# Altium schematic sheet Environmental Sensors.SchDoc
size A4; DrawnBy: Dylan Vogel, Lorna Lan; DocumentNumber: 19; Revision: v4.2; SheetNumber: 19; SheetTotal: 20
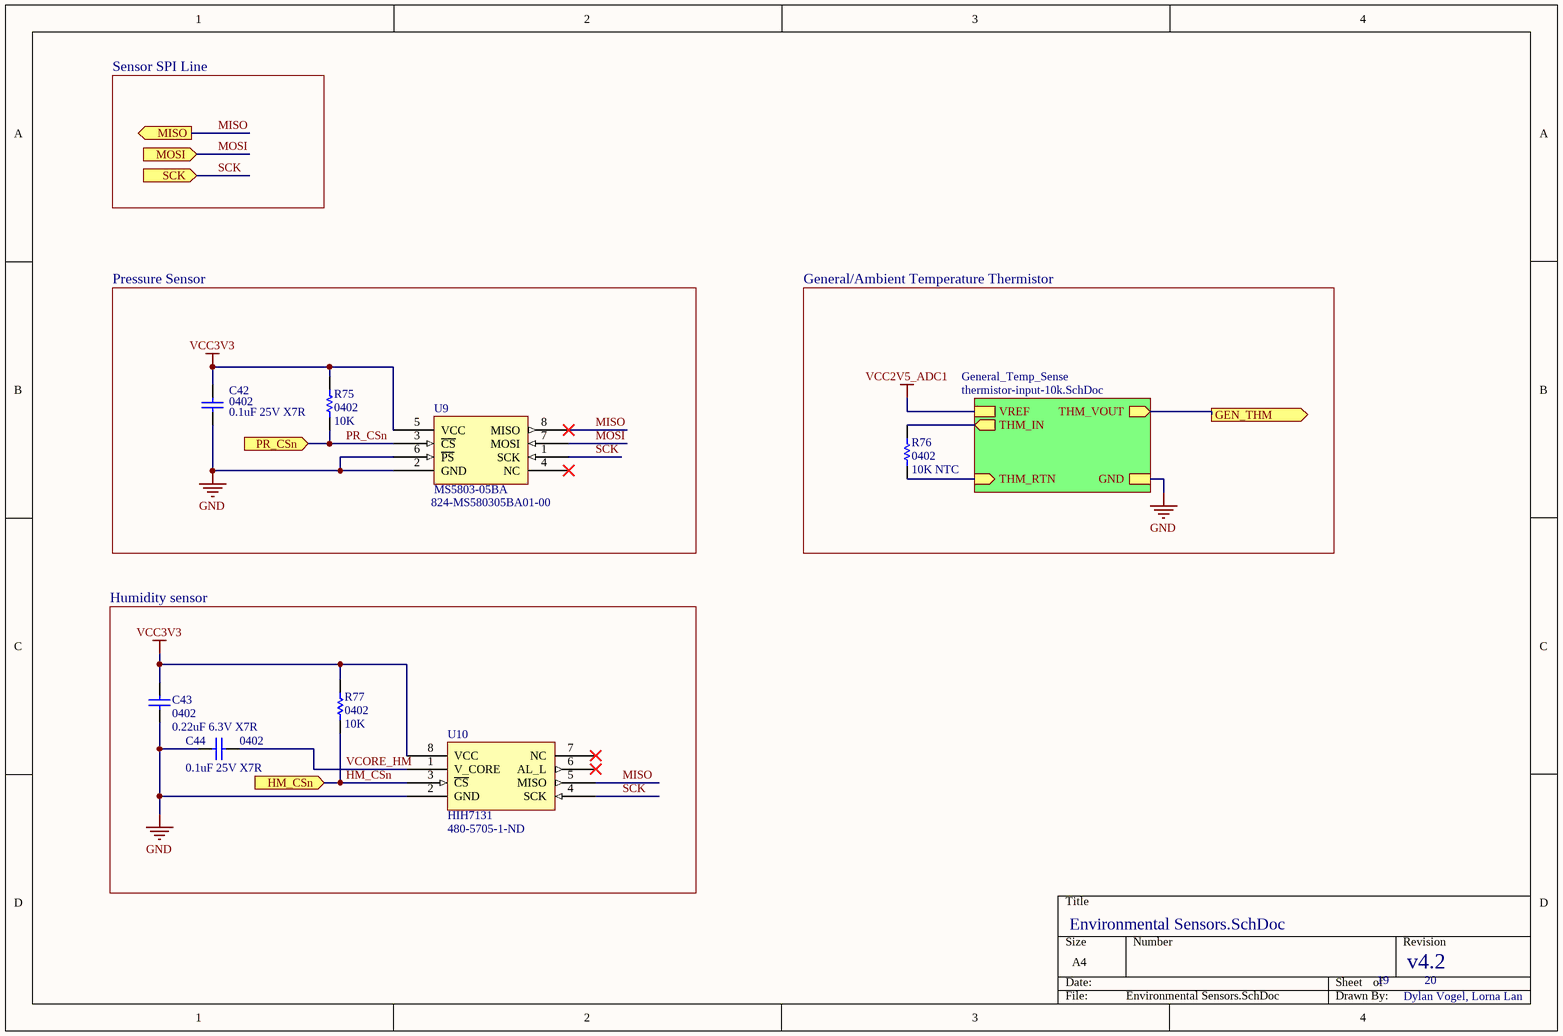
[diagram p0: Environmental Sensors.SchDoc]

## Parts
C42  0402  value 0.1uF 25V X7R  [CAP0402R]
C43  0402  value 0.22uF 6.3V X7R  [CAP0402R]
C44  0402  value 0.1uF 25V X7R  [CAP0402R]
R75  0402  value 10K  [RES0402R]
R76  0402  value 10K NTC  [RES0402R]
R77  0402  value 10K  [RES0402R]
U9  MS5803-05BA  Supplier Part Number 1: 824-MS580305BA01-00  [MS5803_125P640x620-8N]
U10  HIH7131  Supplier Part Number 1: 480-5705-1-ND  [SOIC127P500X600-8N]

## Blocks framed on the sheet
Pressure Sensor: C42 R75 U9
General/Ambient Temperature Thermistor: R76
Humidity sensor: C43 C44 R77 U10

## Sub-sheets
General_Temp_Sense = thermistor-input-10k.SchDoc: GND, VREF, THM_RTN (in), THM_IN (out), THM_VOUT (out)

## Ports
GEN_THM (out), HM_CSn (in), MISO (out), MOSI (in), PR_CSn (in), SCK (in)

## Nets
GND: C42.1 C43.1 C44.1 U9.2(GND) U9.6(~{PS}) U10.2(GND) ; sheet General_Temp_Sense/GND
VCC2V5_ADC1: sheet General_Temp_Sense/VREF
VCC3V3: C42.2 C43.2 R75.2 R77.2 U9.5(VCC) U10.8(VCC)
GEN_THM: port GEN_THM, sheet General_Temp_Sense/THM_VOUT
HM_CSn: R77.1 U10.3(~{CS}) ; port HM_CSn
MISO: U9.8(MISO) U10.5(MISO) ; port MISO
MOSI: U9.7(MOSI) ; port MOSI
PR_CSn: R75.1 U9.3(~{CS}) ; port PR_CSn
SCK: U9.1(SCK) U10.4(SCK) ; port SCK
VCORE_HM: C44.2 U10.1(V_CORE)
NetR76_1: R76.1 ; sheet General_Temp_Sense/THM_RTN
NetR76_2: R76.2 ; sheet General_Temp_Sense/THM_IN

Not connected (* = marked no-connect by the designer): U9 4(NC)*; U10 6(AL_L)* 7(NC)*

## Notes on the sheet
- Sensor SPI Line

## Library data of the parts
C42-C44 = CAP0402: 0402 capacitor
R75 R77 = RES0402: 0402 resistor; Manufacturer: Panasonic; Manufacturer Part Number: ERJ-2RKF1002X; Resistance: 10kR; Power Rating: 100mW; Tolerance: 1%; Voltage Rating: 50V; Temperature Coefficient: 100ppm/°C; Supplier 1: Digi-Key; Supplier Part Number 1: P10.0KLCT-ND; Stock 1: 14350001; Pricing 1: 1=0.1, 10=0.045, 100=0.0183, 1000=0.00823, 2500=0.00715, 5000=0.0059 (USD); Mount: Surface Mount; Case/Package: 0402; Number of Pins: 2; Case Code (Metric): 1005; Case Code (Imperial): 0402; Contact Plating: Tin; Min Operating Temperature: -55°C; Max Operating Temperature: 155°C; Packaging: Tape and Reel; Package Quantity: 1; Composition: Thick Film; Number of Terminations: 2; Termination: SMD/SMT; Military Standard: Not; Max Power Dissipation: 100mW; Voltage Rating (DC): 50V; Features: Automotive AEC-Q200; Length: 1mm; Height: 0.35mm; Width: 0.02inch; Depth: 0.5mm; Radiation Hardening: No; REACH SVHC: No SVHC; Lead Free: Lead Free; ComponentLink1URL: http://industrial.panasonic.com/www-data/pdf/AOA0000/AOA0000CE2.pdf?src-supplier=Future+Electronics; ComponentLink1Description: http://industrial.panasonic.com/www-data/pdf/AOA0000/AOA0000CE2.pdf?src-supplier=Future+Electronics; ComponentLink2URL: http://industrial.panasonic.com/www-data/pdf/AOA0000/AOA0000CE2.pdf?src-supplier=Avnet+Europe; ComponentLink2Description: http://industrial.panasonic.com/www-data/pdf/AOA0000/AOA0000CE2.pdf?src-supplier=Avnet+Europe; ComponentLink3URL: https://industrial.panasonic.com/cdbs/www-data/pdf/RDA0000/DMA0000COL11.pdf?src-supplier=Mouser; ComponentLink3Description: https://industrial.panasonic.com/cdbs/www-data/pdf/RDA0000/DMA0000COL11.pdf?src-supplier=Mouser; ComponentLink4URL: http://www.farnell.com/datasheets/1678782.pdf?src-supplier=Element14; ComponentLink4Description: http://www.farnell.com/datasheets/1678782.pdf?src-supplier=Element14; ComponentLink5URL: http://www.farnell.com/datasheets/1911175.pdf?src-supplier=Farnell; ComponentLink5Description: http://www.farnell.com/datasheets/1911175.pdf?src-supplier=Farnell; ComponentLink6URL: http://www.jameco.com/Jameco/Products/ProdDS/1987020.pdf?src-supplier=Jameco; ComponentLink6Description: http://www.jameco.com/Jameco/Products/ProdDS/1987020.pdf?src-supplier=Jameco; ComponentLink7URL: http://industrial.panasonic.com/www-data/pdf/AOA0000/AOA0000CE2.pdf?src-supplier=Avnet; ComponentLink7Description: http://industrial.panasonic.com/www-data/pdf/AOA0000/AOA0000CE2.pdf?src-supplier=Avnet; ComponentLink8URL: http://www.alliedelec.com/m/d/623f45ff1957d936ff56d46fd1c28cac.pdf?src-supplier=Allied+Electronics; ComponentLink8Description: http://www.alliedelec.com/m/d/623f45ff1957d936ff56d46fd1c28cac.pdf?src-supplier=Allied+Electronics
R76 = RES0402: 0402 resistor
U9 = MS5803-05BA: Digital 24-bit pressure sensor with SPI output. Operating range from 0-5bar, includes onboard temperature sensor and hermetic seal.; ComponentLink1Description: 14BA-Datasheet; ComponentLink1URL: https://www.te.com/commerce/DocumentDelivery/DDEController?Action=srchrtrv&DocNm=MS5803-14BA&DocType=Data+Sheet&DocLang=English; ComponentLink2Description: 05BA-Datasheet; ComponentLink2URL: https://www.te.com/commerce/DocumentDelivery/DDEController?Action=srchrtrv&DocNm=MS5803-05BA&DocType=Data+Sheet&DocLang=English; Supplier 1: Mouser
U10 = HIH7131: Digital humidity/temperature sensors. +/- 3% RH, 0-100%, SPI output. Model version with filter and condensation resistant.; Supplier 1: Digi-Key; Supplier: Digi-Key; Supplier Part Number: 480-5705-1-ND; ComponentLink1Description: Datasheet; ComponentLink1URL: https://sensing.honeywell.com/index.php?ci_id=147071